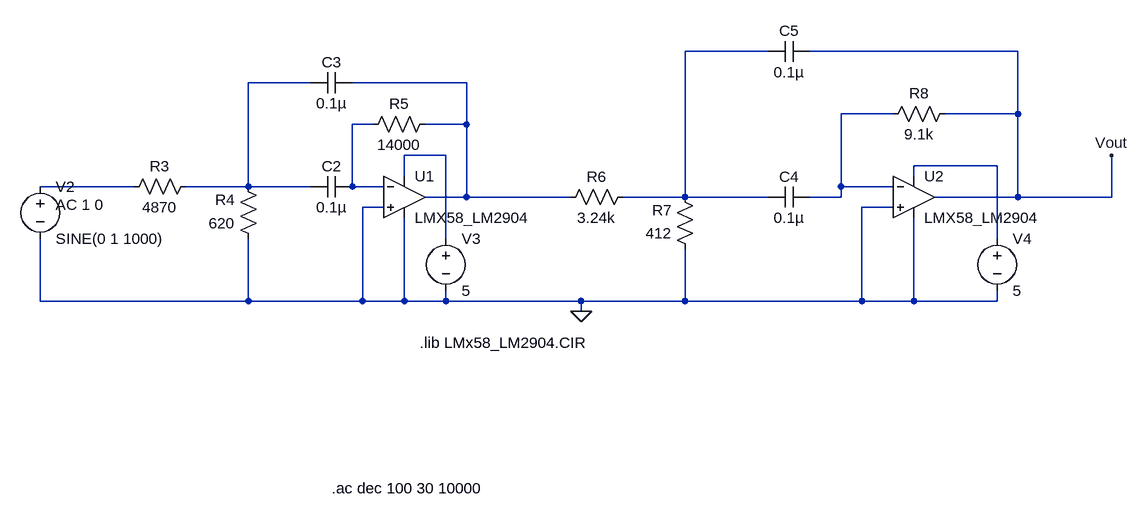
[diagram p0: schematic BandPass.asc]
BandPass.asc, the LTspice schematic file:
Version 4
SHEET 1 880 680
WIRE 272 -1360 144 -1360
WIRE 656 -1360 336 -1360
WIRE -432 -1312 -528 -1312
WIRE -192 -1312 -368 -1312
WIRE 464 -1264 384 -1264
WIRE 656 -1264 656 -1360
WIRE 656 -1264 544 -1264
WIRE -336 -1248 -368 -1248
WIRE -192 -1248 -192 -1312
WIRE -192 -1248 -256 -1248
WIRE -224 -1200 -288 -1200
WIRE 624 -1184 496 -1184
WIRE -288 -1168 -288 -1200
WIRE 496 -1168 496 -1184
WIRE -704 -1152 -848 -1152
WIRE -528 -1152 -528 -1312
WIRE -528 -1152 -624 -1152
WIRE -432 -1152 -528 -1152
WIRE -368 -1152 -368 -1248
WIRE -320 -1152 -368 -1152
WIRE 384 -1152 384 -1264
WIRE 464 -1152 384 -1152
WIRE -192 -1136 -192 -1248
WIRE -192 -1136 -256 -1136
WIRE -32 -1136 -192 -1136
WIRE 144 -1136 144 -1360
WIRE 144 -1136 48 -1136
WIRE 272 -1136 144 -1136
WIRE 384 -1136 384 -1152
WIRE 384 -1136 336 -1136
WIRE 656 -1136 656 -1264
WIRE 656 -1136 528 -1136
WIRE 800 -1136 800 -1200
WIRE 800 -1136 656 -1136
WIRE -320 -1120 -352 -1120
WIRE 464 -1120 416 -1120
WIRE -224 -1072 -224 -1200
WIRE 624 -1072 624 -1184
WIRE -848 -976 -848 -1072
WIRE -528 -976 -528 -1072
WIRE -528 -976 -848 -976
WIRE -352 -976 -352 -1120
WIRE -352 -976 -528 -976
WIRE -288 -976 -288 -1104
WIRE -288 -976 -352 -976
WIRE -224 -976 -224 -992
WIRE -224 -976 -288 -976
WIRE -16 -976 -224 -976
WIRE 144 -976 144 -1056
WIRE 144 -976 -16 -976
WIRE 416 -976 416 -1120
WIRE 416 -976 144 -976
WIRE 496 -976 496 -1104
WIRE 496 -976 416 -976
WIRE 624 -976 624 -992
WIRE 624 -976 496 -976
WIRE -16 -960 -16 -976
FLAG -16 -960 0
FLAG 800 -1200 Vout
SYMBOL voltage -848 -1168 R0
WINDOW 123 24 44 Left 2
WINDOW 39 0 0 Left 0
SYMATTR InstName V2
SYMATTR Value SINE(0 1 1000)
SYMATTR Value2 AC 1 0
SYMBOL res -608 -1168 R90
WINDOW 0 0 56 VBottom 2
WINDOW 3 32 56 VTop 2
SYMATTR InstName R3
SYMATTR Value 4870
SYMBOL res -512 -1056 R180
WINDOW 0 36 76 Left 2
WINDOW 3 36 40 Left 2
SYMATTR InstName R4
SYMATTR Value 620
SYMBOL cap -368 -1168 R90
WINDOW 0 0 32 VBottom 2
WINDOW 3 32 32 VTop 2
SYMATTR InstName C2
SYMATTR Value 0.1µ
SYMBOL cap -368 -1328 R90
WINDOW 0 0 32 VBottom 2
WINDOW 3 32 32 VTop 2
SYMATTR InstName C3
SYMATTR Value 0.1µ
SYMBOL OpAmps\\opamp2 -288 -1200 R0
SYMATTR InstName U1
SYMATTR Value LMX58_LM2904
SYMBOL OpAmps\\opamp2 496 -1200 R0
SYMATTR InstName U2
SYMATTR Value LMX58_LM2904
SYMBOL res -240 -1264 R90
WINDOW 0 0 56 VBottom 2
WINDOW 3 32 56 VTop 2
SYMATTR InstName R5
SYMATTR Value 14000
SYMBOL voltage -224 -1088 R0
WINDOW 123 0 0 Left 0
WINDOW 39 0 0 Left 0
SYMATTR InstName V3
SYMATTR Value 5
SYMBOL res 64 -1152 R90
WINDOW 0 0 56 VBottom 2
WINDOW 3 32 56 VTop 2
SYMATTR InstName R6
SYMATTR Value 3.24k
SYMBOL res 160 -1040 R180
WINDOW 0 36 76 Left 2
WINDOW 3 36 40 Left 2
SYMATTR InstName R7
SYMATTR Value 412
SYMBOL res 448 -1248 R270
WINDOW 0 32 56 VTop 2
WINDOW 3 0 56 VBottom 2
SYMATTR InstName R8
SYMATTR Value 9.1k
SYMBOL cap 336 -1152 R90
WINDOW 0 0 32 VBottom 2
WINDOW 3 32 32 VTop 2
SYMATTR InstName C4
SYMATTR Value 0.1µ
SYMBOL cap 336 -1376 R90
WINDOW 0 0 32 VBottom 2
WINDOW 3 32 32 VTop 2
SYMATTR InstName C5
SYMATTR Value 0.1µ
SYMBOL voltage 624 -1088 R0
WINDOW 123 0 0 Left 0
WINDOW 39 0 0 Left 0
SYMATTR InstName V4
SYMATTR Value 5
TEXT -264 -912 Left 2 !.lib LMx58_LM2904.CIR
TEXT -400 -688 Left 2 !.ac dec 100 30 10000

The netlist it stands for:
* BandPass.asc
V2 N008 0 SINE(0 1 1000) AC 1 0
R3 N002 N008 4870
R4 0 N002 620
C2 N005 N002 0.1µ
C3 N003 N002 0.1µ
XU1 0 N005 N006 0 N003 LMX58_LM2904  ; pins In+ In- V+ V- OUT
XU2 0 N004 N007 0 Vout LMX58_LM2904  ; pins In+ In- V+ V- OUT
R5 N003 N005 14000
V3 N006 0 5
R6 N001 N003 3.24k
R7 0 N001 412
R8 N004 Vout 9.1k
C4 N004 N001 0.1µ
C5 Vout N001 0.1µ
V4 N007 0 5
.lib LMx58_LM2904.CIR
.ac dec 100 30 10000
.backanno
.end